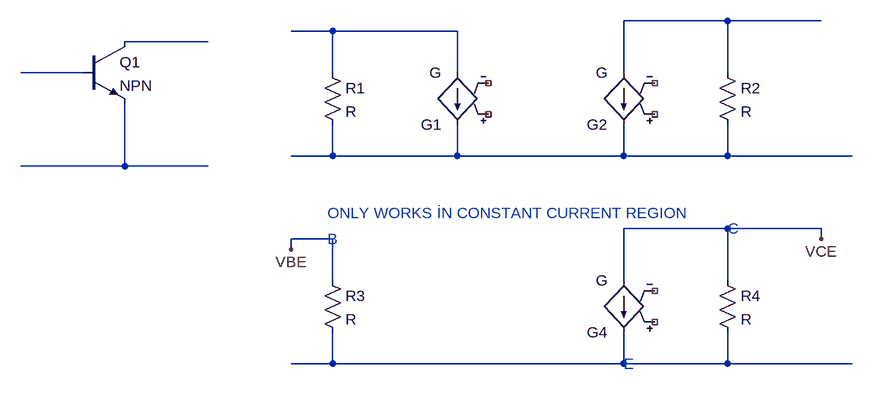
[diagram p0: schematic Draft60.asc]
Draft60.asc, the LTspice schematic file:
Version 4
SHEET 1 1316 680
WIRE 1104 48 944 48
WIRE 1248 48 1104 48
WIRE 496 64 432 64
WIRE 688 64 496 64
WIRE 304 80 176 80
WIRE 112 128 16 128
WIRE 496 128 496 64
WIRE 688 128 688 64
WIRE 944 128 944 48
WIRE 1104 128 1104 48
WIRE 496 256 496 208
WIRE 496 256 432 256
WIRE 688 256 688 208
WIRE 688 256 496 256
WIRE 944 256 944 208
WIRE 944 256 688 256
WIRE 1104 256 1104 208
WIRE 1104 256 944 256
WIRE 1296 256 1104 256
WIRE 176 272 176 176
WIRE 176 272 16 272
WIRE 304 272 176 272
WIRE 1104 368 944 368
WIRE 1248 368 1104 368
WIRE 496 384 432 384
WIRE 1248 384 1248 368
WIRE 432 400 432 384
WIRE 496 448 496 384
WIRE 944 448 944 368
WIRE 1104 448 1104 368
WIRE 496 576 496 528
WIRE 496 576 432 576
WIRE 944 576 944 528
WIRE 944 576 496 576
WIRE 1104 576 1104 528
WIRE 1104 576 944 576
WIRE 1296 576 1104 576
FLAG 1248 384 VCE
FLAG 432 400 VBE
SYMBOL npn 112 80 R0
SYMATTR InstName Q1
SYMBOL res 480 112 R0
SYMATTR InstName R1
SYMBOL res 1088 112 R0
SYMATTR InstName R2
SYMBOL g 688 224 R180
SYMATTR InstName G1
SYMBOL g 944 224 R180
SYMATTR InstName G2
SYMBOL res 480 432 R0
SYMATTR InstName R3
SYMBOL res 1088 432 R0
SYMATTR InstName R4
SYMBOL g 944 544 R180
SYMATTR InstName G4
TEXT 488 384 Left 2 ;B
TEXT 944 576 Left 2 ;E
TEXT 1104 368 Left 2 ;C
TEXT 488 344 Left 2 ;ONLY WORKS İN CONSTANT CURRENT REGION

The netlist it stands for:
* Draft60.asc
Q1 N003 N004 N006 0 NPN
R1 N002 N005 R
R2 N001 N005 R
G1 N002 N005 NC_01 NC_02 G
G2 N001 N005 NC_03 NC_04 G
R3 VBE N007 R
R4 VCE N007 R
G4 VCE N007 NC_05 NC_06 G
.model NPN NPN
.model PNP PNP
.lib standard.bjt
* B
* E
* C
* ONLY WORKS İN CONSTANT CURRENT REGION
.backanno
.end